# Altium schematic sheet ONOFF (1).SchDoc
size A2
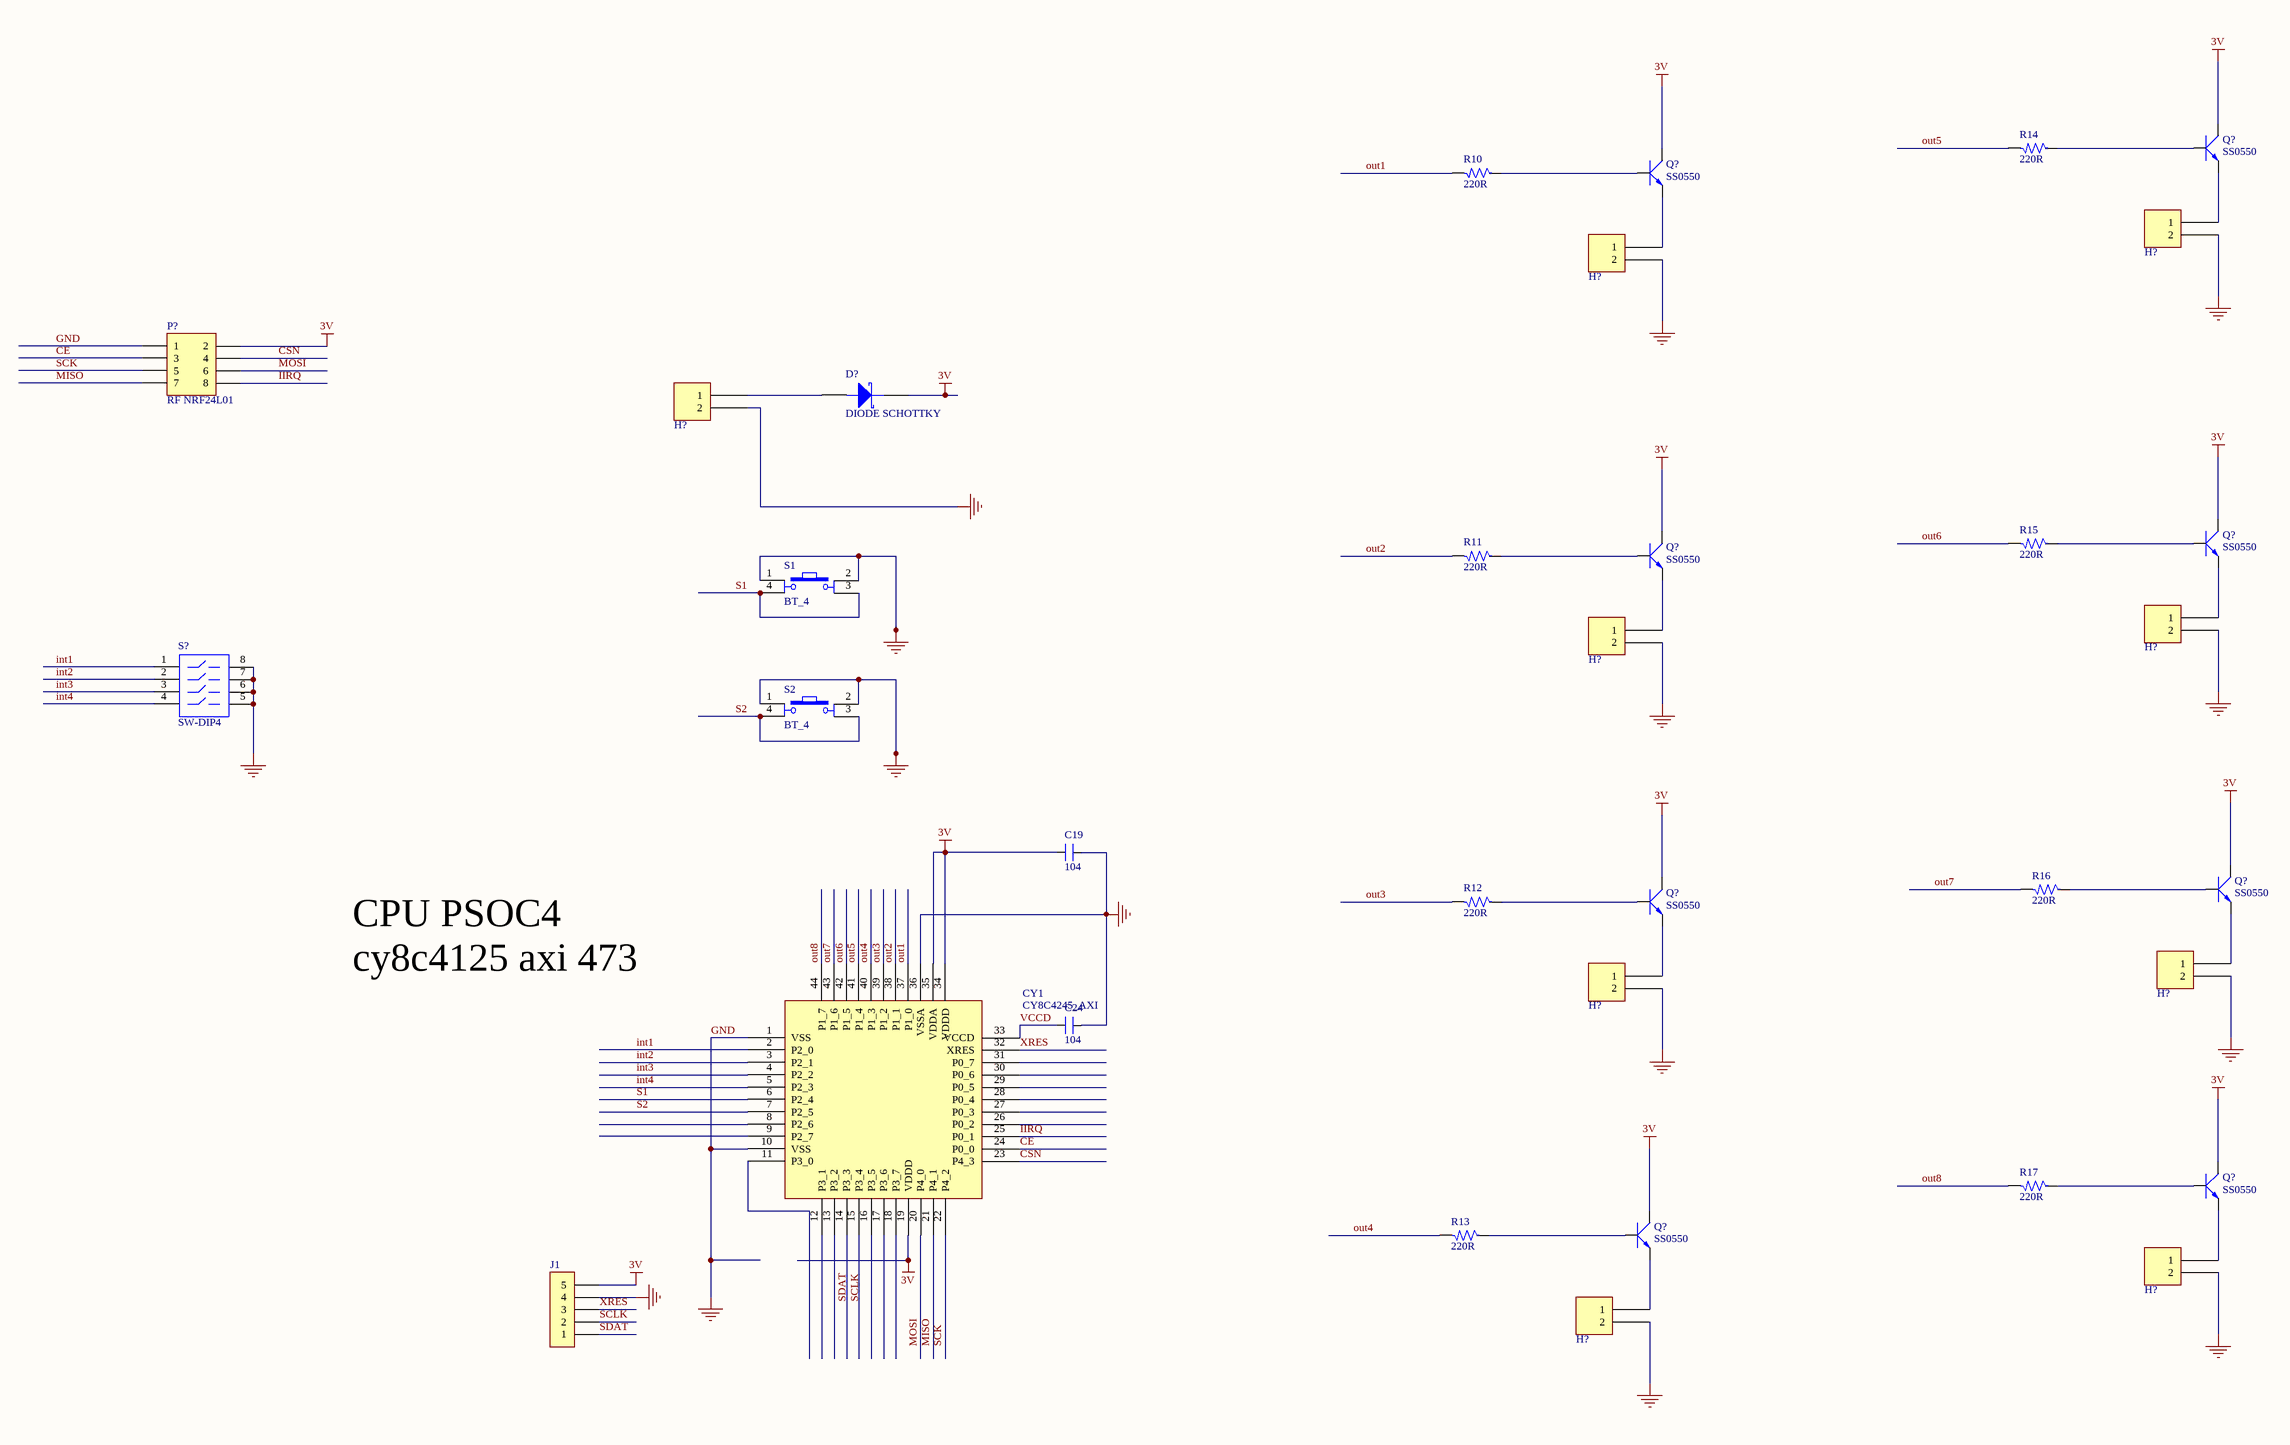
[diagram p0: ONOFF (1).SchDoc]

## Parts
(Parts that share a designator on the sheet are numbered #1, #2 ... from top to bottom, then left to right.)
C19  104  [SM-0805]
C24  104  [SM-0805]
CY1  CY8C4245_AXI  [AXI 44]
D?  DIODE SCHOTTKY  [SMA]
H?#1  Header 2  [CON2]  (value not drawn)
H?#2  Header 2  [CON2]  (value not drawn)
H?#3  Header 2  [CON2]  (value not drawn)
H?#4  Header 2  [CON2]  (value not drawn)
H?#5  Header 2  [CON2]  (value not drawn)
H?#6  Header 2  [CON2]  (value not drawn)
H?#7  Header 2  [CON2]  (value not drawn)
H?#8  Header 2  [CON2]  (value not drawn)
H?#9  Header 2  [CON2]  (value not drawn)
J1  (no value)  [JP5]
P?  RF NRF24L01  [HDR2X4]
Q?#1  SS0550  [SOT23B]
Q?#2  SS0550  [SOT23B]
Q?#3  SS0550  [SOT23B]
Q?#4  SS0550  [SOT23B]
Q?#5  SS0550  [SOT23B]
Q?#6  SS0550  [SOT23B]
Q?#7  SS0550  [SOT23B]
Q?#8  SS0550  [SOT23B]
R10  220R  [SMD-0805]
R11  220R  [SMD-0805]
R12  220R  [SMD-0805]
R13  220R  [SMD-0805]
R14  220R  [SMD-0805]
R15  220R  [SMD-0805]
R16  220R  [SMD-0805]
R17  220R  [SMD-0805]
S1  BT_4  [BUTTON]
S2  BT_4  [BUTTON]
S?  SW-DIP4  [DIP-8]

## Nets
3V: C19.1 CY1.19(VDDD) CY1.34(VDDD) CY1.35(VDDA) D?.2(K) J1.5 P?.2 Q?#1.3(C) Q?#2.3(C) Q?#3.3(C) Q?#4.3(C) Q?#5.3(C) Q?#6.3(C) Q?#7.3(C) Q?#8.3(C)
GND: C19.2 C24.2 CY1.1(VSS) CY1.10(VSS) CY1.36(VSSA) H?#1.2 H?#2.2 H?#3.2 H?#4.2 H?#5.2 H?#6.2 H?#7.2 H?#8.2 H?#9.2 J1.4 P?.1 S1.1 S1.2 S2.1 S2.2 S?.5 S?.6 S?.7 S?.8
CE: CY1.24(P0_0) P?.3
CSN: CY1.23(P4_3) P?.4
IIRQ: CY1.25(P0_1) P?.8
int1: CY1.2(P2_0) S?.1
int2: CY1.3(P2_1) S?.2
int3: CY1.4(P2_2) S?.3
int4: CY1.5(P2_3) S?.4
MISO: CY1.21(P4_1) P?.7
MOSI: CY1.20(P4_0) P?.6
out1: CY1.37(P1_0) R10.2
out2: CY1.38(P1_1) R11.2
out3: CY1.39(P1_2) R12.2
out4: CY1.40(P1_3) R13.2
out5: CY1.41(P1_4) R14.2
out6: CY1.42(P1_5) R15.2
out7: CY1.43(P1_6) R16.2
out8: CY1.44(P1_7) R17.2
S1: CY1.6(P2_4) S1.3 S1.4
S2: CY1.7(P2_5) S2.3 S2.4
SCK: CY1.22(P4_2) P?.5
SCLK: CY1.14(P3_3) J1.2
SDAT: CY1.13(P3_2) J1.1
VCCD: C24.1 CY1.33(VCCD)
XRES: CY1.32(XRES) J1.3
NetD?_1: D?.1(A) H?#3.1
NetH?#1_1: H?#1.1 Q?#1.2(E)
NetH?#2_1: H?#2.1 Q?#2.2(E)
NetH?#4_1: H?#4.1 Q?#3.2(E)
NetH?#5_1: H?#5.1 Q?#4.2(E)
NetH?#6_1: H?#6.1 Q?#5.2(E)
NetH?#7_1: H?#7.1 Q?#6.2(E)
NetH?#8_1: H?#8.1 Q?#7.2(E)
NetH?#9_1: H?#9.1 Q?#8.2(E)
NetQ?#1_1: Q?#1.1(B) R14.1
NetQ?#2_1: Q?#2.1(B) R10.1
NetQ?#3_1: Q?#3.1(B) R15.1
NetQ?#4_1: Q?#4.1(B) R11.1
NetQ?#5_1: Q?#5.1(B) R16.1
NetQ?#6_1: Q?#6.1(B) R12.1
NetQ?#7_1: Q?#7.1(B) R17.1
NetQ?#8_1: Q?#8.1(B) R13.1

Not connected (* = marked no-connect by the designer): CY1 8(P2_6) 9(P2_7) 11(P3_0) 12(P3_1) 15(P3_4) 16(P3_5) 17(P3_6) 18(P3_7) 26(P0_2) 27(P0_3) 28(P0_4) 29(P0_5) 30(P0_6) 31(P0_7)

## Notes on the sheet
- CPU PSOC4
  cy8c4125 axi 473
- Title
- Size:
- Date:
- File:
- A2
- Number:
- Time:
- Revision:
- Sheet
- of

## Library data of the parts
C19 C24 = CM: Cap SMD; Value: 103
D? = DIODE SCHOTTKY: Schottky Diode
J1 = CON5: Connector
P? = Header 4X2: Header, 4-Pin, Dual row; LatestRevisionDate: 17-Jul-2002; LatestRevisionNote: Re-released for DXP Platform.; Publisher: Altium Limited
Q?#1-Q?#8 = C1815: NPN 600mW, ECB; Value: C1815
R10-R17 = R: Resistor 1/4W; Value: R1/4W - 1K